# Altium schematic sheet 电磁阀驱动.SchDoc
size A2
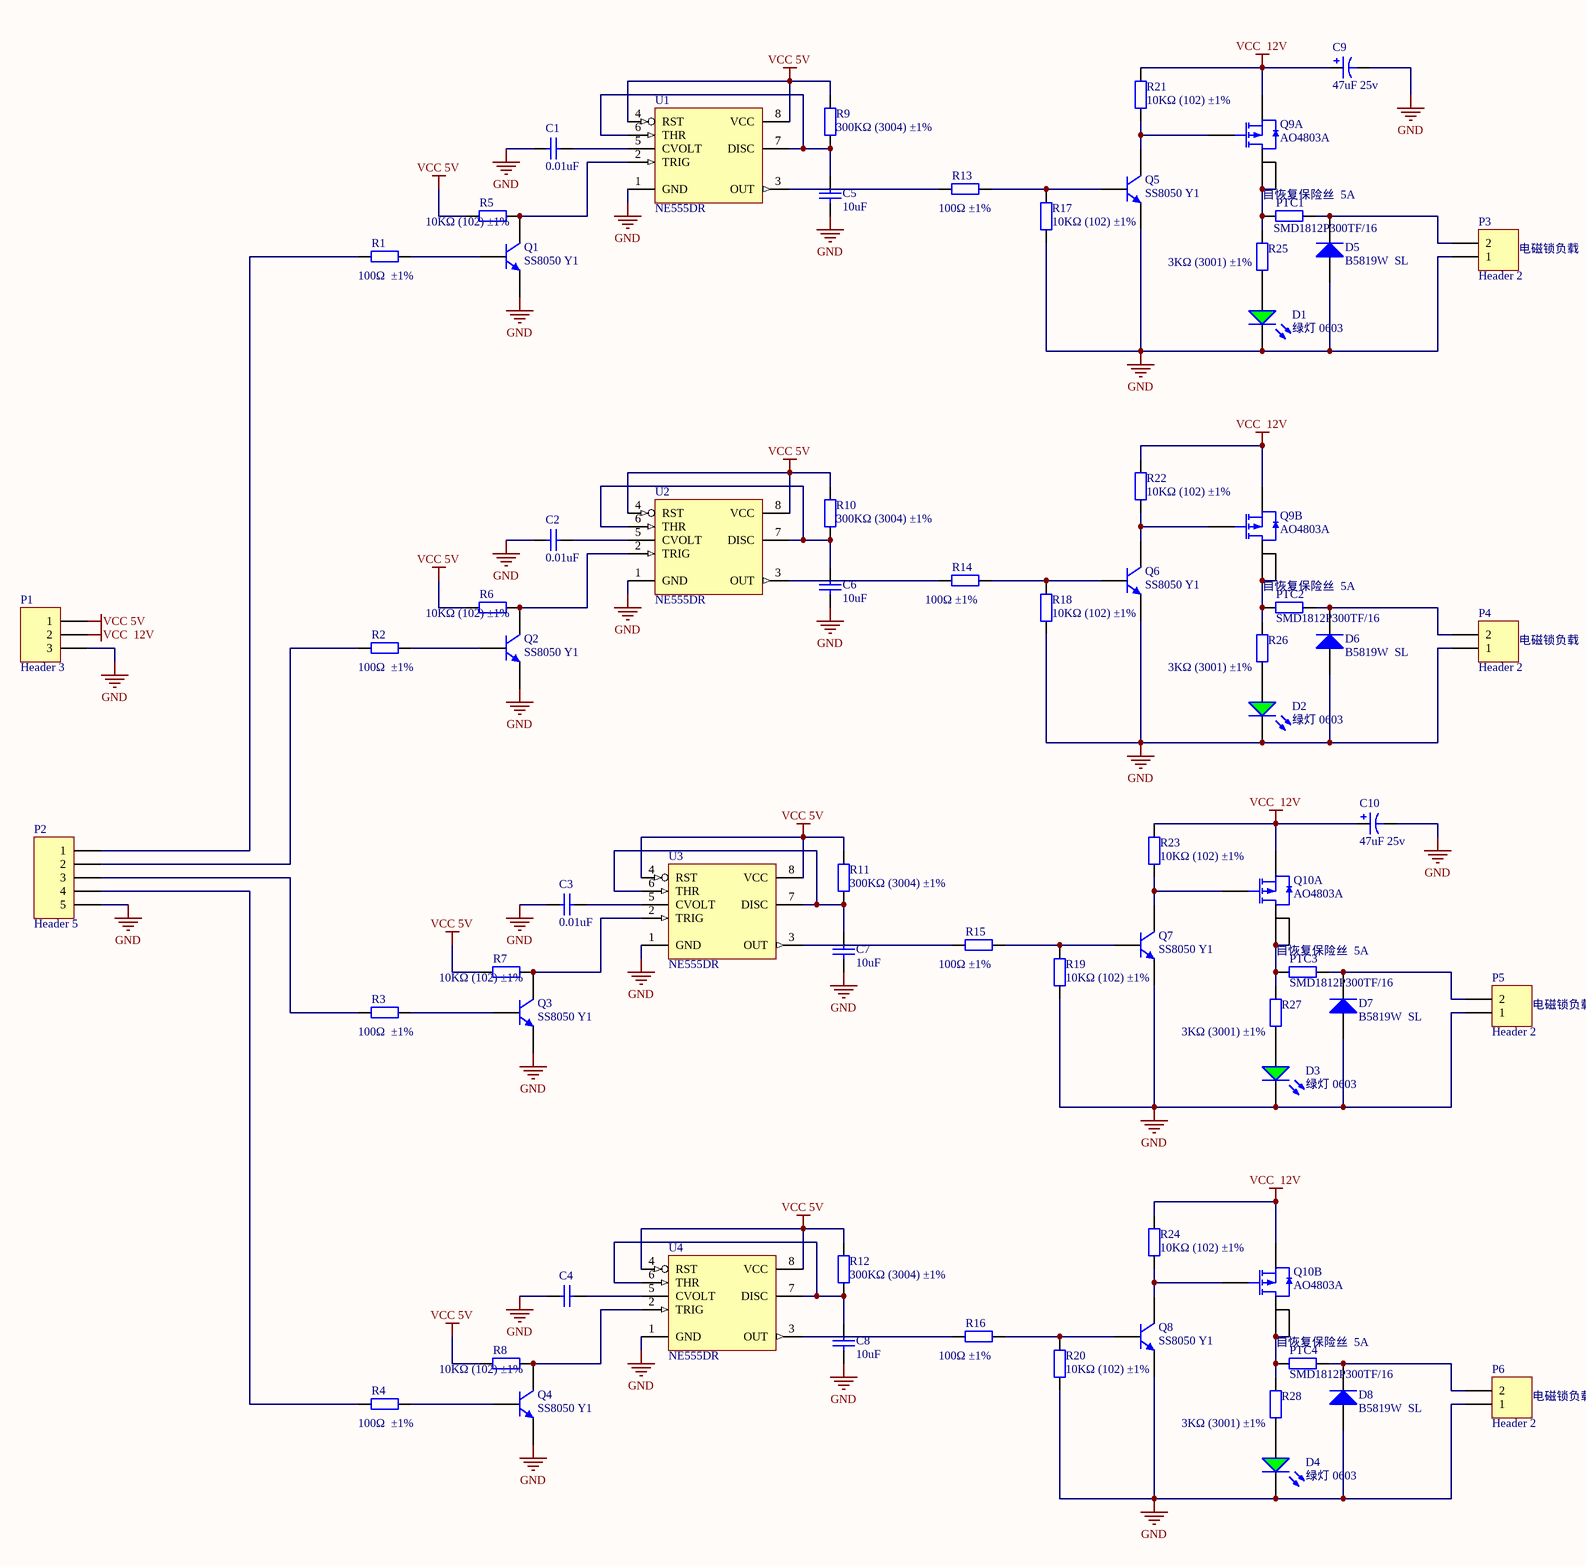
[diagram p0: 电磁阀驱动.SchDoc]

## Parts
C1  0.01uF  [0603C]
C2  0.01uF  [0603C]
C3  0.01uF  [0603C]
C4  0.01uF  [0603C]  (value not drawn)
C5  10uF  [0603C]
C6  10uF  [0603C]
C7  10uF  [0603C]
C8  10uF  [0603C]
C9  47uF 25v  [CAP_SMD_6*7]
C10  47uF 25v  [CAP_SMD_6*7]
D1  绿灯 0603  [0603_LED_S1]
D2  绿灯 0603  [0603_LED_S1]
D3  绿灯 0603  [0603_LED_S1]
D4  绿灯 0603  [0603_LED_S1]
D5  B5819W  SL  [SOD-123]
D6  B5819W  SL  [SOD-123]
D7  B5819W  SL  [SOD-123]
D8  B5819W  SL  [SOD-123]
P1  Header 3  [sip-3]
P2  Header 5  [SIP-5]
P3  Header 2  [SIP-2]
P4  Header 2  [SIP-2]
P5  Header 2  [SIP-2]
P6  Header 2  [SIP-2]
PTC1  SMD1812P300TF/16  [1812]
PTC2  SMD1812P300TF/16  [1812]
PTC3  SMD1812P300TF/16  [1812]
PTC4  SMD1812P300TF/16  [1812]
Q1  SS8050 Y1  [SOT-23(SOT-23-3)]
Q2  SS8050 Y1  [SOT-23(SOT-23-3)]
Q3  SS8050 Y1  [SOT-23(SOT-23-3)]
Q4  SS8050 Y1  [SOT-23(SOT-23-3)]
Q5  SS8050 Y1  [SOT-23(SOT-23-3)]
Q6  SS8050 Y1  [SOT-23(SOT-23-3)]
Q7  SS8050 Y1  [SOT-23(SOT-23-3)]
Q8  SS8050 Y1  [SOT-23(SOT-23-3)]
Q9  AO4803A  [SOP-8_150mil]  (parts A,B of 2)
Q10  AO4803A  [SOP-8_150mil]  (parts A,B of 2)
R1  100Ω  ±1%  [0603_R]
R2  100Ω  ±1%  [0603_R]
R3  100Ω  ±1%  [0603_R]
R4  100Ω  ±1%  [0603_R]
R5  10KΩ (102) ±1%  [0603_R]
R6  10KΩ (102) ±1%  [0603_R]
R7  10KΩ (102) ±1%  [0603_R]
R8  10KΩ (102) ±1%  [0603_R]
R9  300KΩ (3004) ±1%  [0603_R]
R10  300KΩ (3004) ±1%  [0603_R]
R11  300KΩ (3004) ±1%  [0603_R]
R12  300KΩ (3004) ±1%  [0603_R]
R13  100Ω ±1%  [0603_R]
R14  100Ω ±1%  [0603_R]
R15  100Ω ±1%  [0603_R]
R16  100Ω ±1%  [0603_R]
R17  10KΩ (102) ±1%  [0603_R]
R18  10KΩ (102) ±1%  [0603_R]
R19  10KΩ (102) ±1%  [0603_R]
R20  10KΩ (102) ±1%  [0603_R]
R21  10KΩ (102) ±1%  [0603_R]
R22  10KΩ (102) ±1%  [0603_R]
R23  10KΩ (102) ±1%  [0603_R]
R24  10KΩ (102) ±1%  [0603_R]
R25  3KΩ (3001) ±1%  [0603_R]
R26  3KΩ (3001) ±1%  [0603_R]
R27  3KΩ (3001) ±1%  [0603_R]
R28  3KΩ (3001) ±1%  [0603_R]
U1  NE555DR  [SOIC-8_150mil]
U2  NE555DR  [SOIC-8_150mil]
U3  NE555DR  [SOIC-8_150mil]
U4  NE555DR  [SOIC-8_150mil]

## Nets
GND: C1.1 C2.1 C3.1 C4.1 C5.1 C6.1 C7.1 C8.1 C9.2 C10.2 D1.K D2.K D3.K D4.K D5.1(A) D6.1(A) D7.1(A) D8.1(A) P1.3 P2.5 P3.1 P4.1 P5.1 P6.1 Q1.2(E) Q2.2(E) Q3.2(E) Q4.2(E) Q5.2(E) Q6.2(E) Q7.2(E) Q8.2(E) R17.1 R18.1 R19.1 R20.1 U1.1(GND) U2.1(GND) U3.1(GND) U4.1(GND)
VCC 5V: P1.1 R5.2 R6.2 R7.2 R8.2 R9.1 R10.1 R11.1 R12.1 U1.4(RST) U1.8(VCC) U2.4(RST) U2.8(VCC) U3.4(RST) U3.8(VCC) U4.4(RST) U4.8(VCC)
VCC  12V: C9.1 C10.1 P1.2 Q9.1(S) Q9.3(S) Q10.1(S) Q10.3(S) R21.2 R22.2 R23.2 R24.2
NetC1_2: C1.2 U1.5(CVOLT)
NetC2_2: C2.2 U2.5(CVOLT)
NetC3_2: C3.2 U3.5(CVOLT)
NetC4_2: C4.2 U4.5(CVOLT)
NetC5_2: C5.2 R9.2 U1.6(THR) U1.7(DISC)
NetC6_2: C6.2 R10.2 U2.6(THR) U2.7(DISC)
NetC7_2: C7.2 R11.2 U3.6(THR) U3.7(DISC)
NetC8_2: C8.2 R12.2 U4.6(THR) U4.7(DISC)
NetD1_A: D1.A R25.2
NetD2_A: D2.A R26.2
NetD3_A: D3.A R27.2
NetD4_A: D4.A R28.2
NetD5_2: D5.2(K) P3.2 PTC1.2
NetD6_2: D6.2(K) P4.2 PTC2.2
NetD7_2: D7.2(K) P5.2 PTC3.2
NetD8_2: D8.2(K) P6.2 PTC4.2
NetP2_1: P2.1 R1.2
NetP2_2: P2.2 R2.2
NetP2_3: P2.3 R3.2
NetP2_4: P2.4 R4.2
NetPTC1_1: PTC1.1 Q9.7(D) Q9.8(D) R25.1
NetPTC2_1: PTC2.1 Q9.5(D) Q9.6(D) R26.1
NetPTC3_1: PTC3.1 Q10.7(D) Q10.8(D) R27.1
NetPTC4_1: PTC4.1 Q10.5(D) Q10.6(D) R28.1
NetQ1_1: Q1.1(B) R1.1
NetQ1_3: Q1.3(C) R5.1 U1.2(TRIG)
NetQ2_1: Q2.1(B) R2.1
NetQ2_3: Q2.3(C) R6.1 U2.2(TRIG)
NetQ3_1: Q3.1(B) R3.1
NetQ3_3: Q3.3(C) R7.1 U3.2(TRIG)
NetQ4_1: Q4.1(B) R4.1
NetQ4_3: Q4.3(C) R8.1 U4.2(TRIG)
NetQ5_1: Q5.1(B) R13.2 R17.2
NetQ5_3: Q5.3(C) Q9.2(G) R21.1
NetQ6_1: Q6.1(B) R14.2 R18.2
NetQ6_3: Q6.3(C) Q9.4(G) R22.1
NetQ7_1: Q7.1(B) R15.2 R19.2
NetQ7_3: Q7.3(C) Q10.2(G) R23.1
NetQ8_1: Q8.1(B) R16.2 R20.2
NetQ8_3: Q8.3(C) Q10.4(G) R24.1
NetR13_1: R13.1 U1.3(OUT)
NetR14_1: R14.1 U2.3(OUT)
NetR15_1: R15.1 U3.3(OUT)
NetR16_1: R16.1 U4.3(OUT)

## Notes on the sheet
- (near PTC1) 自恢复保险丝  5A
- (near P3) 电磁锁负载
- (near PTC2) 自恢复保险丝  5A
- (near P4) 电磁锁负载
- (near PTC3) 自恢复保险丝  5A
- (near P5) 电磁锁负载
- (near PTC4) 自恢复保险丝  5A
- (near P6) 电磁锁负载
- Title
- Size:
- Date:
- File:
- A2
- Number:
- Time:
- Revision:
- Sheet
- of

## Library data of the parts
C1-C4 = Cap: Capacitor; Published: 8-Jun-2000; LatestRevisionDate: 17-Jul-2002; LatestRevisionNote: Re-released for DXP Platform.; PackageReference: RAD-0.3; Publisher: Altium Limited; PackageDescription: Radial Cap, Thru-Hole; 2 Leads; 0.3 in Pin Spacing; Value: 0.01uf
C5-C8 = Cap: Capacitor; Value: 0.01uf; Published: 8-Jun-2000; LatestRevisionDate: 17-Jul-2002; LatestRevisionNote: Re-released for DXP Platform.; PackageReference: RAD-0.3; Publisher: Altium Limited; PackageDescription: Radial Cap, Thru-Hole; 2 Leads; 0.3 in Pin Spacing
C9 C10 = Cap Pol1: Polarized Capacitor (Radial); Value: 100pF; Published: 8-Jun-2000; LatestRevisionDate: 17-Jul-2002; LatestRevisionNote: Re-released for DXP Platform.; PackageReference: RB7.6-15; Publisher: Altium Limited; PackageDescription: Polarized Capacitor (Radial); 2 Leads
D1-D4 = 0603 绿灯: 发光二极管; ComponentLink1Description: 供应商链接; ComponentLink1URL: http://www.szlcsc.com/product/details_73152.html; Package: 0603; Supplier: LC; SuppliersPartNumber: C72043
D5-D8 = SOD-123 B5819W  SL: 肖特基二极管; ComponentLink1Description: 供应商链接; ComponentLink1URL: http://www.szlcsc.com/product/details_9093.html; Package: SOD-123; Supplier: LC; SuppliersPartNumber: C8598
P1 = Header 3: Header, 3-Pin; LatestRevisionDate: 17-Jul-2002; LatestRevisionNote: Re-released for DXP Platform.; Publisher: Altium Limited
P2 = Header 5: Header, 5-Pin; LatestRevisionDate: 17-Jul-2002; LatestRevisionNote: Re-released for DXP Platform.; Publisher: Altium Limited
P3-P6 = Header 2: Header, 2-Pin; LatestRevisionDate: 17-Jul-2002; LatestRevisionNote: Re-released for DXP Platform.; Publisher: Altium Limited
PTC1-PTC4 = 0603 3KΩ (3001) 1%: 自恢复保险丝; ComponentLink1Description: 供应商链接; ComponentLink1URL: http://www.szlcsc.com/product/details_4618.html; Package: 0603; Supplier: LC; SuppliersPartNumber: C4211
Q1-Q8 = SOT-23 SS8050 Y1: 三极管; ComponentLink1Description: 供应商链接; ComponentLink1URL: http://www.szlcsc.com/product/details_2507.html; Package: SOT-23; Supplier: LC; SuppliersPartNumber: C2150
Q9 Q10 = APM4953KC-TRG: MOS(场效应管); ComponentLink1Description: 供应商链接; ComponentLink1URL: http://www.szlcsc.com/product/details_21609.html; Package: SOP-8_150mil; Supplier: LC; SuppliersPartNumber: C20897
R1-R28 = 0603 3KΩ (3001) 1%: 贴片电阻; ComponentLink1Description: 供应商链接; ComponentLink1URL: http://www.szlcsc.com/product/details_4618.html; Package: 0603; Supplier: LC; SuppliersPartNumber: C4211
U1-U4 = NE555DR_[C7593]: 时基集成; ComponentLink1Description: 供应商链接; ComponentLink1URL: http://www.szlcsc.com/product/details_8070.html; Package: SOIC-8_150mil; Supplier: LC; SuppliersPartNumber: C7593